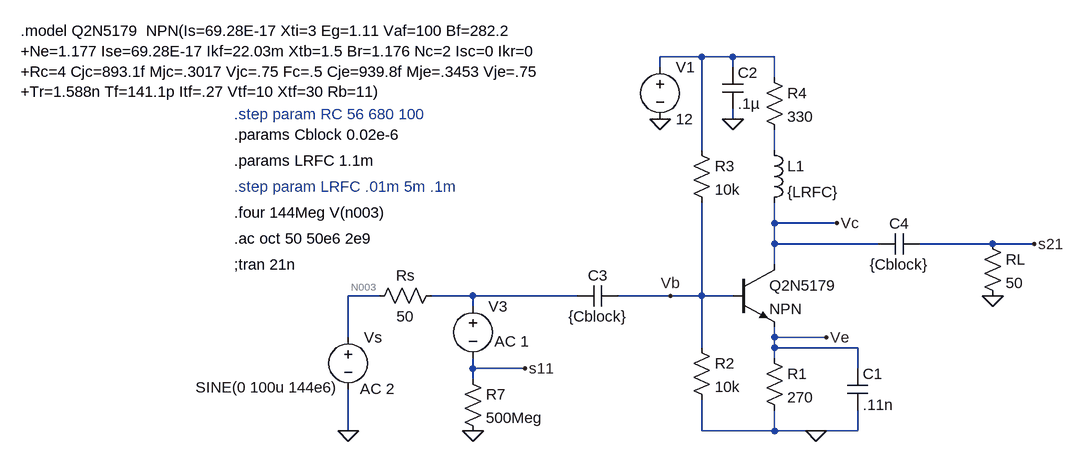
[diagram p0: schematic ECE_522_LNA_v2.asc]
ECE_522_LNA_v2.asc, the LTspice schematic file:
Version 4
SHEET 1 948 680
WIRE 144 -160 80 -160
WIRE 192 -160 144 -160
WIRE 256 -160 192 -160
WIRE 80 -144 80 -160
WIRE 192 -144 192 -160
WIRE 256 -128 256 -160
WIRE 192 -64 192 -80
WIRE 144 -16 144 -160
WIRE 256 -16 256 -48
WIRE 256 96 256 64
WIRE 352 96 256 96
WIRE 256 128 256 96
WIRE 416 128 256 128
WIRE 592 128 480 128
WIRE 656 128 592 128
WIRE 256 160 256 128
WIRE -352 208 -400 208
WIRE -208 208 -272 208
WIRE -48 208 -208 208
WIRE 96 208 16 208
WIRE 144 208 144 64
WIRE 144 208 96 208
WIRE 192 208 144 208
WIRE -208 224 -208 208
WIRE -400 272 -400 208
WIRE 256 272 256 256
WIRE 336 272 256 272
WIRE 144 288 144 208
WIRE 256 288 256 272
WIRE 384 288 256 288
WIRE 256 304 256 288
WIRE -208 320 -208 304
WIRE -128 320 -208 320
WIRE 384 320 384 288
WIRE -208 336 -208 320
WIRE -400 416 -400 352
WIRE 144 416 144 368
WIRE 256 416 256 384
WIRE 256 416 144 416
WIRE 320 416 256 416
WIRE 384 416 384 384
WIRE 384 416 320 416
FLAG 80 -64 0
FLAG 320 416 0
FLAG 192 -64 0
FLAG -400 416 0
FLAG 592 208 0
FLAG -208 416 0
FLAG -128 320 s11
FLAG 656 128 s21
FLAG 352 96 Vc
FLAG 336 272 Ve
FLAG 96 208 Vb
SYMBOL voltage 80 -160 R0
WINDOW 123 0 0 Left 2
WINDOW 39 0 0 Left 2
SYMATTR InstName V1
SYMATTR Value 12
SYMBOL npn 192 160 R0
SYMATTR InstName Q2N5179
SYMBOL res 240 288 R0
SYMATTR InstName R1
SYMATTR Value 270
SYMBOL cap 368 320 R0
SYMATTR InstName C1
SYMATTR Value .11n
SYMBOL cap 176 -144 R0
SYMATTR InstName C2
SYMATTR Value .1µ
SYMBOL res 128 272 R0
SYMATTR InstName R2
SYMATTR Value 10k
SYMBOL res 128 -32 R0
SYMATTR InstName R3
SYMATTR Value 10k
SYMBOL cap 16 192 R90
WINDOW 0 0 32 VBottom 2
WINDOW 3 32 32 VTop 2
SYMATTR InstName C3
SYMATTR Value {Cblock}
SYMBOL cap 480 112 R90
WINDOW 0 0 32 VBottom 2
WINDOW 3 32 32 VTop 2
SYMATTR InstName C4
SYMATTR Value {Cblock}
SYMBOL voltage -400 256 R0
WINDOW 3 -235 93 Left 2
WINDOW 123 18 95 Left 2
WINDOW 39 0 0 Left 2
SYMATTR Value SINE(0 100u 144e6)
SYMATTR Value2 AC 2
SYMATTR InstName Vs
SYMBOL res 576 112 R0
SYMATTR InstName RL
SYMATTR Value 50
SYMBOL res -256 192 R90
WINDOW 0 0 56 VBottom 2
WINDOW 3 32 56 VTop 2
SYMATTR InstName Rs
SYMATTR Value 50
SYMBOL voltage -208 208 R0
WINDOW 123 33 70 Left 2
WINDOW 39 0 0 Left 2
SYMATTR Value2 AC 1
SYMATTR InstName V3
SYMATTR Value ""
SYMBOL res -224 320 R0
SYMATTR InstName R7
SYMATTR Value 500Meg
SYMBOL res 240 -144 R0
SYMATTR InstName R4
SYMATTR Value 330
SYMBOL ind 240 -32 R0
SYMATTR InstName L1
SYMATTR Value {LRFC}
TEXT -904 -200 Left 2 !.model Q2N5179  NPN(Is=69.28E-17 Xti=3 Eg=1.11 Vaf=100 Bf=282.2 \n+Ne=1.177 Ise=69.28E-17 Ikf=22.03m Xtb=1.5 Br=1.176 Nc=2 Isc=0 Ikr=0 \n+Rc=4 Cjc=893.1f Mjc=.3017 Vjc=.75 Fc=.5 Cje=939.8f Mje=.3453 Vje=.75 \n+Tr=1.588n Tf=141.1p Itf=.27 Vtf=10 Xtf=30 Rb=11)
TEXT -576 160 Left 2 !;tran 21n
TEXT -576 -40 Left 2 !.params Cblock 0.02e-6
TEXT -576 80 Left 2 !.four 144Meg V(n003)
TEXT -576 40 Left 2 ;.step param LRFC .01m 5m .1m
TEXT -576 0 Left 2 !.params LRFC 1.1m
TEXT -576 120 Left 2 !.ac oct 50 50e6 2e9
TEXT -576 -72 Left 2 ;.step param RC 56 680 100

The netlist it stands for:
* ECE_522_LNA_v2.asc
V1 N001 0 12
Q2N5179 Vc Vb Ve 0 NPN
R1 Ve 0 270
C1 Ve 0 .11n
C2 N001 0 .1µ
R2 Vb 0 10k
R3 N001 Vb 10k
C3 Vb N004 {Cblock}
C4 s21 Vc {Cblock}
Vs N003 0 SINE(0 100u 144e6) AC 2
RL s21 0 50
Rs N004 N003 50
V3 N004 s11 AC 1
R7 s11 0 500Meg
R4 N001 N002 330
L1 N002 Vc {LRFC}
.model NPN NPN
.model PNP PNP
.lib standard.bjt
.model Q2N5179  NPN(Is=69.28E-17 Xti=3 Eg=1.11 Vaf=100 Bf=282.2
+Ne=1.177 Ise=69.28E-17 Ikf=22.03m Xtb=1.5 Br=1.176 Nc=2 Isc=0 Ikr=0
+Rc=4 Cjc=893.1f Mjc=.3017 Vjc=.75 Fc=.5 Cje=939.8f Mje=.3453 Vje=.75
+Tr=1.588n Tf=141.1p Itf=.27 Vtf=10 Xtf=30 Rb=11)
;tran 21n
.params Cblock 0.02e-6
.four 144Meg V(n003)
* .step param LRFC .01m 5m .1m
.params LRFC 1.1m
.ac oct 50 50e6 2e9
* .step param RC 56 680 100
.backanno
.end